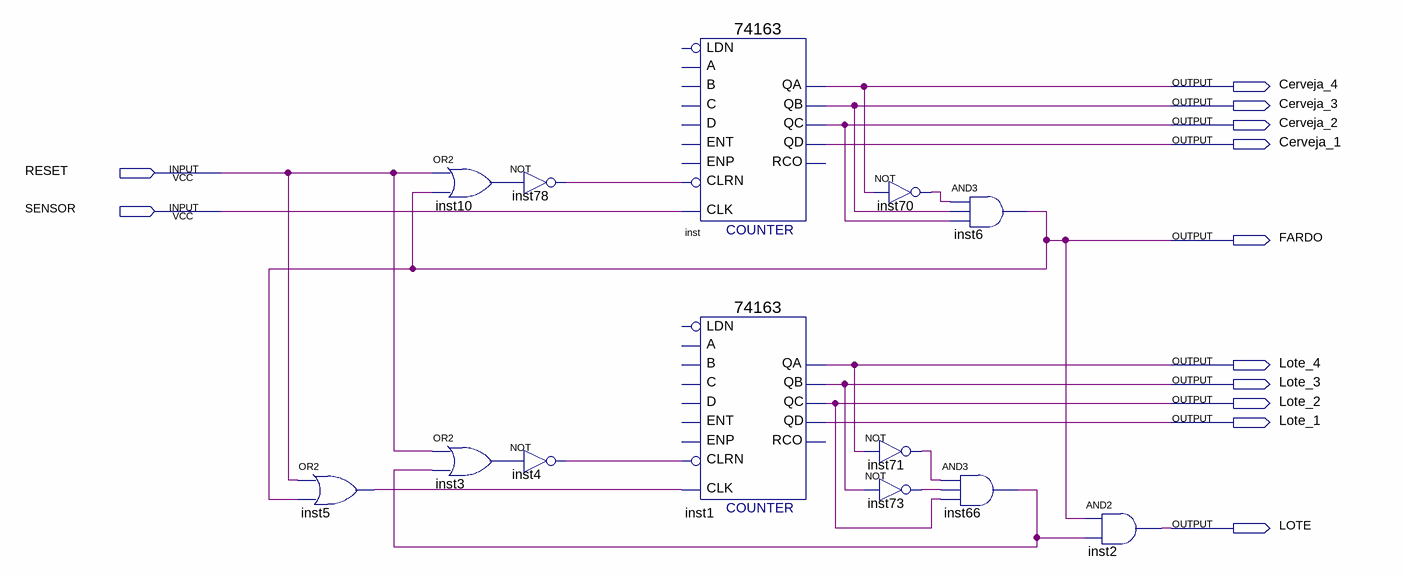
[diagram p0: schematic sheet]
// Quartus schematic cerveja.bdf as structural Verilog: 13 symbols, 12 pins
module cerveja (
  input  RESET,
  input  SENSOR,
  output Cerveja_4,
  output Cerveja_3,
  output Cerveja_2,
  output Cerveja_1,
  output FARDO,
  output Lote_4,
  output Lote_3,
  output Lote_2,
  output Lote_1,
  output LOTE
);

  wire inst3_out, inst4_out, inst5_out, inst10_out, inst66_out, inst70_out, inst71_out, inst73_out,
       inst78_out;

  or inst5 (inst5_out, RESET, FARDO);
  or inst10 (inst10_out, RESET, FARDO);
  or inst3 (inst3_out, RESET, inst66_out);
  not inst78 (inst78_out, inst10_out);
  not inst4 (inst4_out, inst3_out);
  \74163  inst (
    .CLRN(inst78_out), .CLK(SENSOR), .QA(Cerveja_4), .QB(Cerveja_3), .QC(Cerveja_2), .QD(Cerveja_1));  // open: C, B, A, ENT, D, ENP, LDN, RCO
  \74163  inst1 (
    .CLRN(inst4_out), .CLK(inst5_out), .QA(Lote_4), .QB(Lote_3), .QC(Lote_2), .QD(Lote_1));  // open: C, B, A, ENT, D, ENP, LDN, RCO
  not inst70 (inst70_out, Cerveja_4);
  not inst71 (inst71_out, Lote_4);
  not inst73 (inst73_out, Lote_3);
  and inst6 (FARDO, inst70_out, Cerveja_3, Cerveja_2);
  and inst66 (inst66_out, inst71_out, inst73_out, Lote_2);
  and inst2 (LOTE, FARDO, inst66_out);
endmodule
